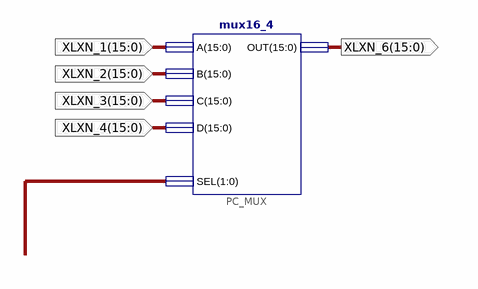
[diagram p0: schematic sheet 1]
// Xilinx ISE schematic choose1of4_16.sch (spartan6) as structural Verilog: 1 symbols, 5 ports
module choose1of4_16 (
  input  [15:0] XLXN_1,
  input  [15:0] XLXN_2,
  input  [15:0] XLXN_3,
  input  [15:0] XLXN_4,
  output [15:0] XLXN_6
);

  wire [1:0] XLXN_7;

  mux16_4 PC_MUX (.A(XLXN_1), .B(XLXN_2), .C(XLXN_3), .D(XLXN_4), .OUT(XLXN_6), .SEL(XLXN_7));
endmodule
